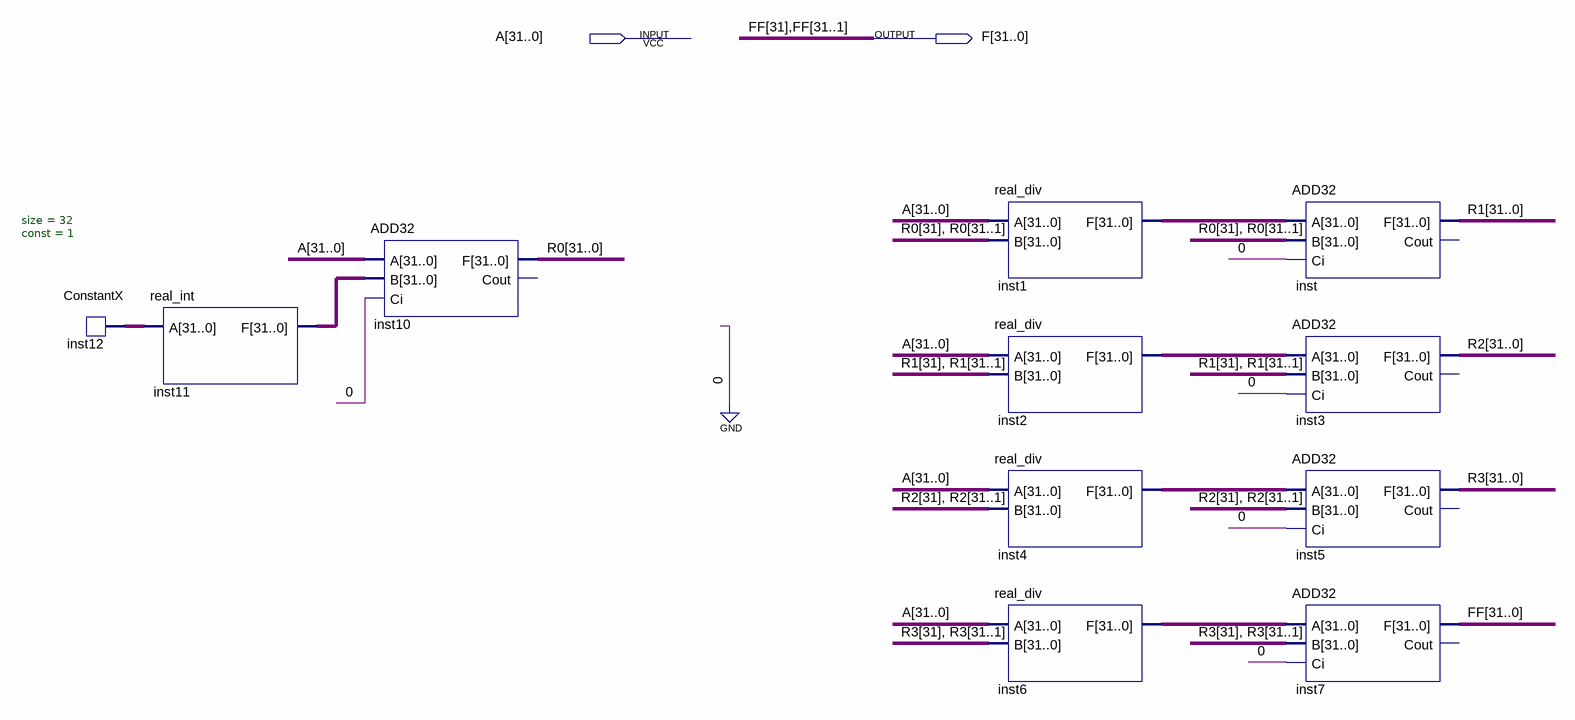
[diagram p0: schematic sheet]
// Quartus schematic real_sqrt.bdf as structural Verilog: 11 symbols, 2 pins
module real_sqrt (
  input  [31:0] A,
  output [31:0] F
);

  wire [0:0] FF;
  wire [31:0] inst1_f, inst2_f, inst4_f, inst6_f, inst11_f, inst12_data_out, R0, R1, R2, R3;

  ConstantX #(.size(32), .\const (1)) inst12 (.DATA_OUT(inst12_data_out));
  real_int inst11 (.A(inst12_data_out), .F(inst11_f));
  ADD32 inst10 (.A(A), .B(inst11_f), .Ci(1'b0), .F(R0));  // open: Cout
  real_div inst1 (.A(A), .B({{2{R0[31]}}, R0[30:1]}), .F(inst1_f));
  real_div inst2 (.A(A), .B({{2{R1[31]}}, R1[30:1]}), .F(inst2_f));
  real_div inst4 (.A(A), .B({{2{R2[31]}}, R2[30:1]}), .F(inst4_f));
  real_div inst6 (.A(A), .B({{2{R3[31]}}, R3[30:1]}), .F(inst6_f));
  ADD32 inst (.A(inst1_f), .B({{2{R0[31]}}, R0[30:1]}), .Ci(1'b0), .F(R1));  // open: Cout
  ADD32 inst3 (.A(inst2_f), .B({{2{R1[31]}}, R1[30:1]}), .Ci(1'b0), .F(R2));  // open: Cout
  ADD32 inst5 (.A(inst4_f), .B({{2{R2[31]}}, R2[30:1]}), .Ci(1'b0), .F(R3));  // open: Cout
  ADD32 inst7 (.A(inst6_f), .B({{2{R3[31]}}, R3[30:1]}), .Ci(1'b0), .F({F[31], F[29:0], FF[0]}));  // open: Cout

  assign F[30] = F[31];

  // Other names for the same wires on the sheet: FF[31:1] = {F[31], F[29:0]}
endmodule
